# EAGLE schematic BMS-Shield (EAGLE 8.0.2)
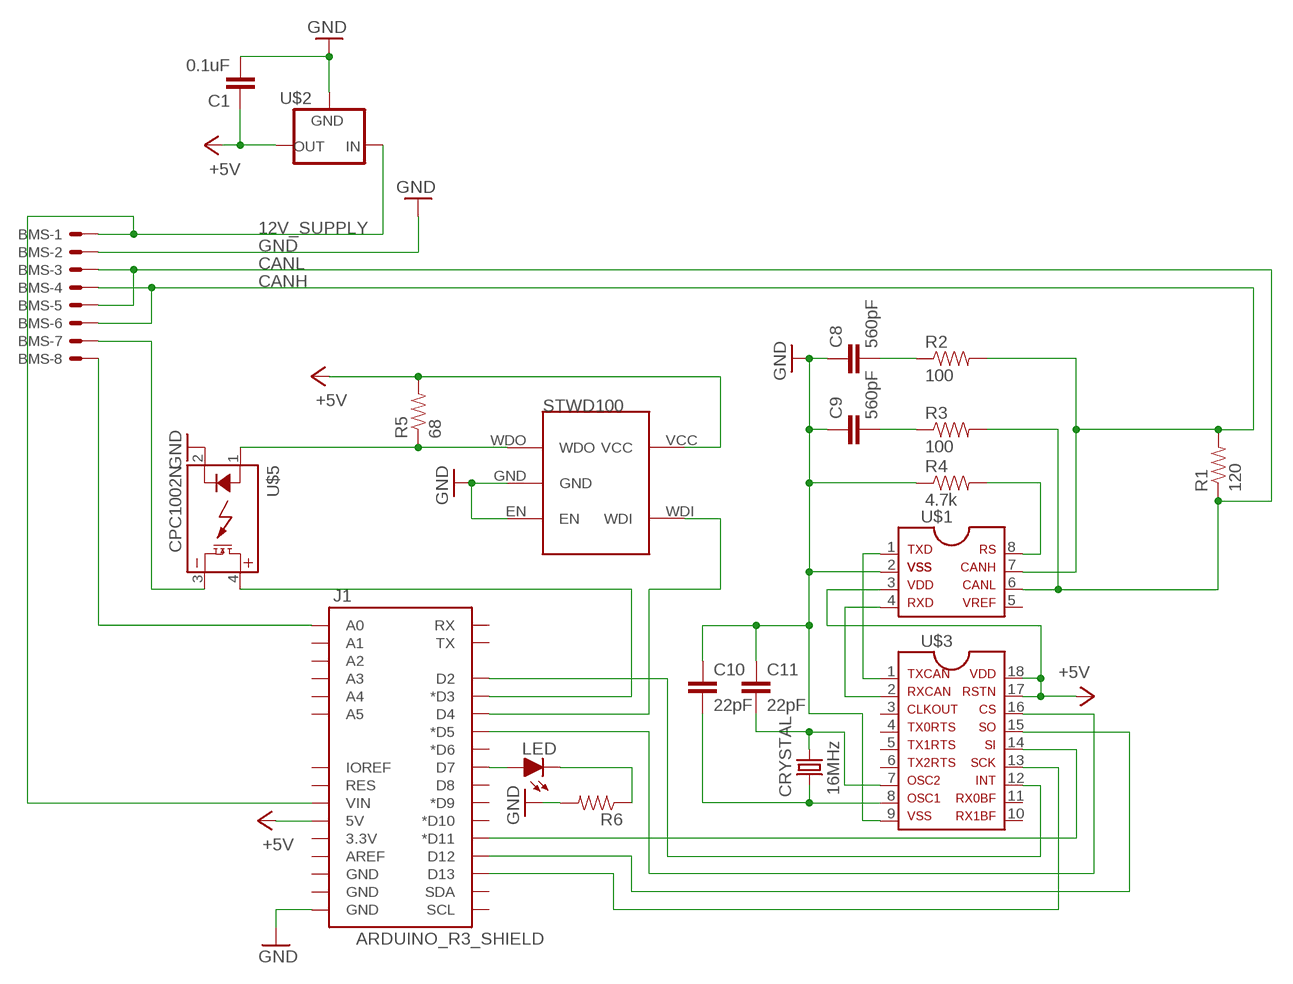
[diagram p0: schematic, sheet 1]

## Parts
BMS  MINIFIT_5566-8  [MINIFIT_5566-8]
C1  0.1uF  CAP0805  [0805@1]
C8  560pF  CAP0805  [0805@1]
C9  560pF  CAP0805  [0805@1]
C10  22pF  CAP0805  [0805@1]
C11  22pF  CAP0805  [0805@1]
CRYSTAL  16MHz  CRYSTALSMD  [HC49UP]
J1  ARDUINO_R3_SHIELD  [UNO_R3_SHIELD]
LED  LED-0805  [LED-805]
R1  120  RESISTOR0805-RES  [0805]
R2  100  RESISTOR0805-RES  [0805]
R3  100  RESISTOR0805-RES  [0805]
R4  4.7k  RESISTOR0805-RES  [0805]
R5  68  RESISTOR0805-RES  [0805]
R6  RESISTOR0805-RES  [0805]
U$1  MCP2551  [SOIC-08]
U$2  5VREG_LM340-NLM340MPX-5.0/NOPB  [SOT223]
U$3  MCP2515SMD  [SOIC-18W]
U$4  STWD100  [SOT23-5]
U$5  CPC1002N  [SOP04]

## Nets
12V_SUPPLY: BMS.1 J1.VIN U$2.1(IN)
+5V: C1.1 J1.5V R5.2 U$1.3 U$2.3(OUT) U$3.17 U$3.18 U$4.VCC
CANH: BMS.4 BMS.6 R1.2 R2.2 U$1.7
CANL: BMS.3 BMS.5 R1.1 R3.2 U$1.6
CS: J1.D5(*D5) U$3.16
GND: BMS.2 C1.2 C8.1 C9.1 C10.1 C11.1 J1.GND@0(GND) R4.1 R6.2 U$1.2 U$2.2(GND) U$2.4(GND) U$3.9 U$4.EN U$4.GND U$5.2(CONTROL-)
N$1: BMS.8 J1.A0
N$2: J1.D12 U$3.15
N$3: J1.D11(*D11) U$3.14
N$4: J1.D13 U$3.13
N$5: R5.1 U$4.WDO U$5.1(CONTROL+)
N$6: J1.D4 U$4.WDI
N$7: J1.D7 LED.A
N$8: BMS.7 U$5.3(DC-)
N$9: J1.D3(*D3) U$5.4(DC+)
N$10: J1.D2 U$3.12
N$11: C10.2 CRYSTAL.2 U$3.8
N$12: U$1.1 U$3.1
N$13: U$1.4 U$3.2
N$14: C8.2 R2.1
N$15: C11.2 CRYSTAL.1 U$3.7
N$16: R4.2 U$1.8
N$17: C9.2 R3.1
N$18: LED.C R6.1
Unconnected: J1.3.3V J1.A1 J1.A2 J1.A3 J1.A4 J1.A5 J1.AREF J1.D6(*D6) J1.D8 J1.D9(*D9) J1.D10(*D10) J1.GND@1(GND) J1.GND@2(GND) J1.IOREF J1.RES J1.RX J1.SCL J1.SDA J1.TX U$1.5 U$3.3 U$3.4 U$3.5 U$3.6 U$3.10 U$3.11

## Library data of the parts
BMS = HyTechDevices:MINIFIT_5566-8: Mini-Fit Junior connector 8 pole Source: http://www.molex.com; OC_FARNELL: unknown; OC_NEWARK: unknown
C1 C8-C11 = HyTechDevices:CAP: Capacitor Standard 0603 ceramic capacitor, and 0.1" leaded capacitor.
CRYSTAL = SparkFun-FreqCtrl:CRYSTAL: Various standard crystals. Proven footprints.
J1 = HyTechDevices:ARDUINO_R3_SHIELD: Shield form compatible with the Arduino Uno R3. Source: Sparkfun <https://github.com/sparkfun/SparkFun-Eagle-Libraries>
LED = HyTechDevices:LED: Light Emitting Diode (LED) Source: Dangerous Prototypes Eagle Library <https://github.com/DangerousPrototypes/Eagle_Part_Library>
R1-R6 = HyTechDevices:RESISTOR: Resistor Basic schematic elements and footprints for 0603, 1206, and PTH resistors.
U$1 = HyTechDevices:MCP2551: MCP2551 High-Speed CAN Transceiver Product Webpage <https://www.microchip.com/wwwproducts/en/MCP2551> Datasheet <http://ww1.microchip.com/downloads/en/DeviceDoc/21667f.pdf> This device is outdated It is replaced by MCP2561. Comparison Page <https://www.microchip.com/wwwproducts/ProductCompare/MCP2551/MCP2561> Product Webpage <https://www.microchip.com/wwwproducts/en/MCP2561> Datasheet <http://ww1.microchip.com/downloads/en/DeviceDoc/20005167C.pdf>
U$2 = HyTechDevices:5VREG_LM340-N: Voltage Regulator 5v linear voltage regulator Datasheet <http://www.mouser.com/ProductDetail/Texas-Instruments/LM340MPX-50-NOPB/?qs=X1J7HmVL2ZGZwtTFRQ9ItA%3D%3D> MAX current out: 1.5A MAX voltage in: 35V
U$3 = HyTechDevices:MCP2515: MCP2515 CAN Controller with SPI Interface Datasheet <http://ww1.microchip.com/downloads/en/DeviceDoc/21801G.pdf>
U$4 = HyTechDevices:STWD100: STWD100 Watchdog timer
U$5 = HyTechDevices:CPC1002N: IXYS Solid State Relay .7A